# EAGLE design main_board_smd (EAGLE 6.6.0)
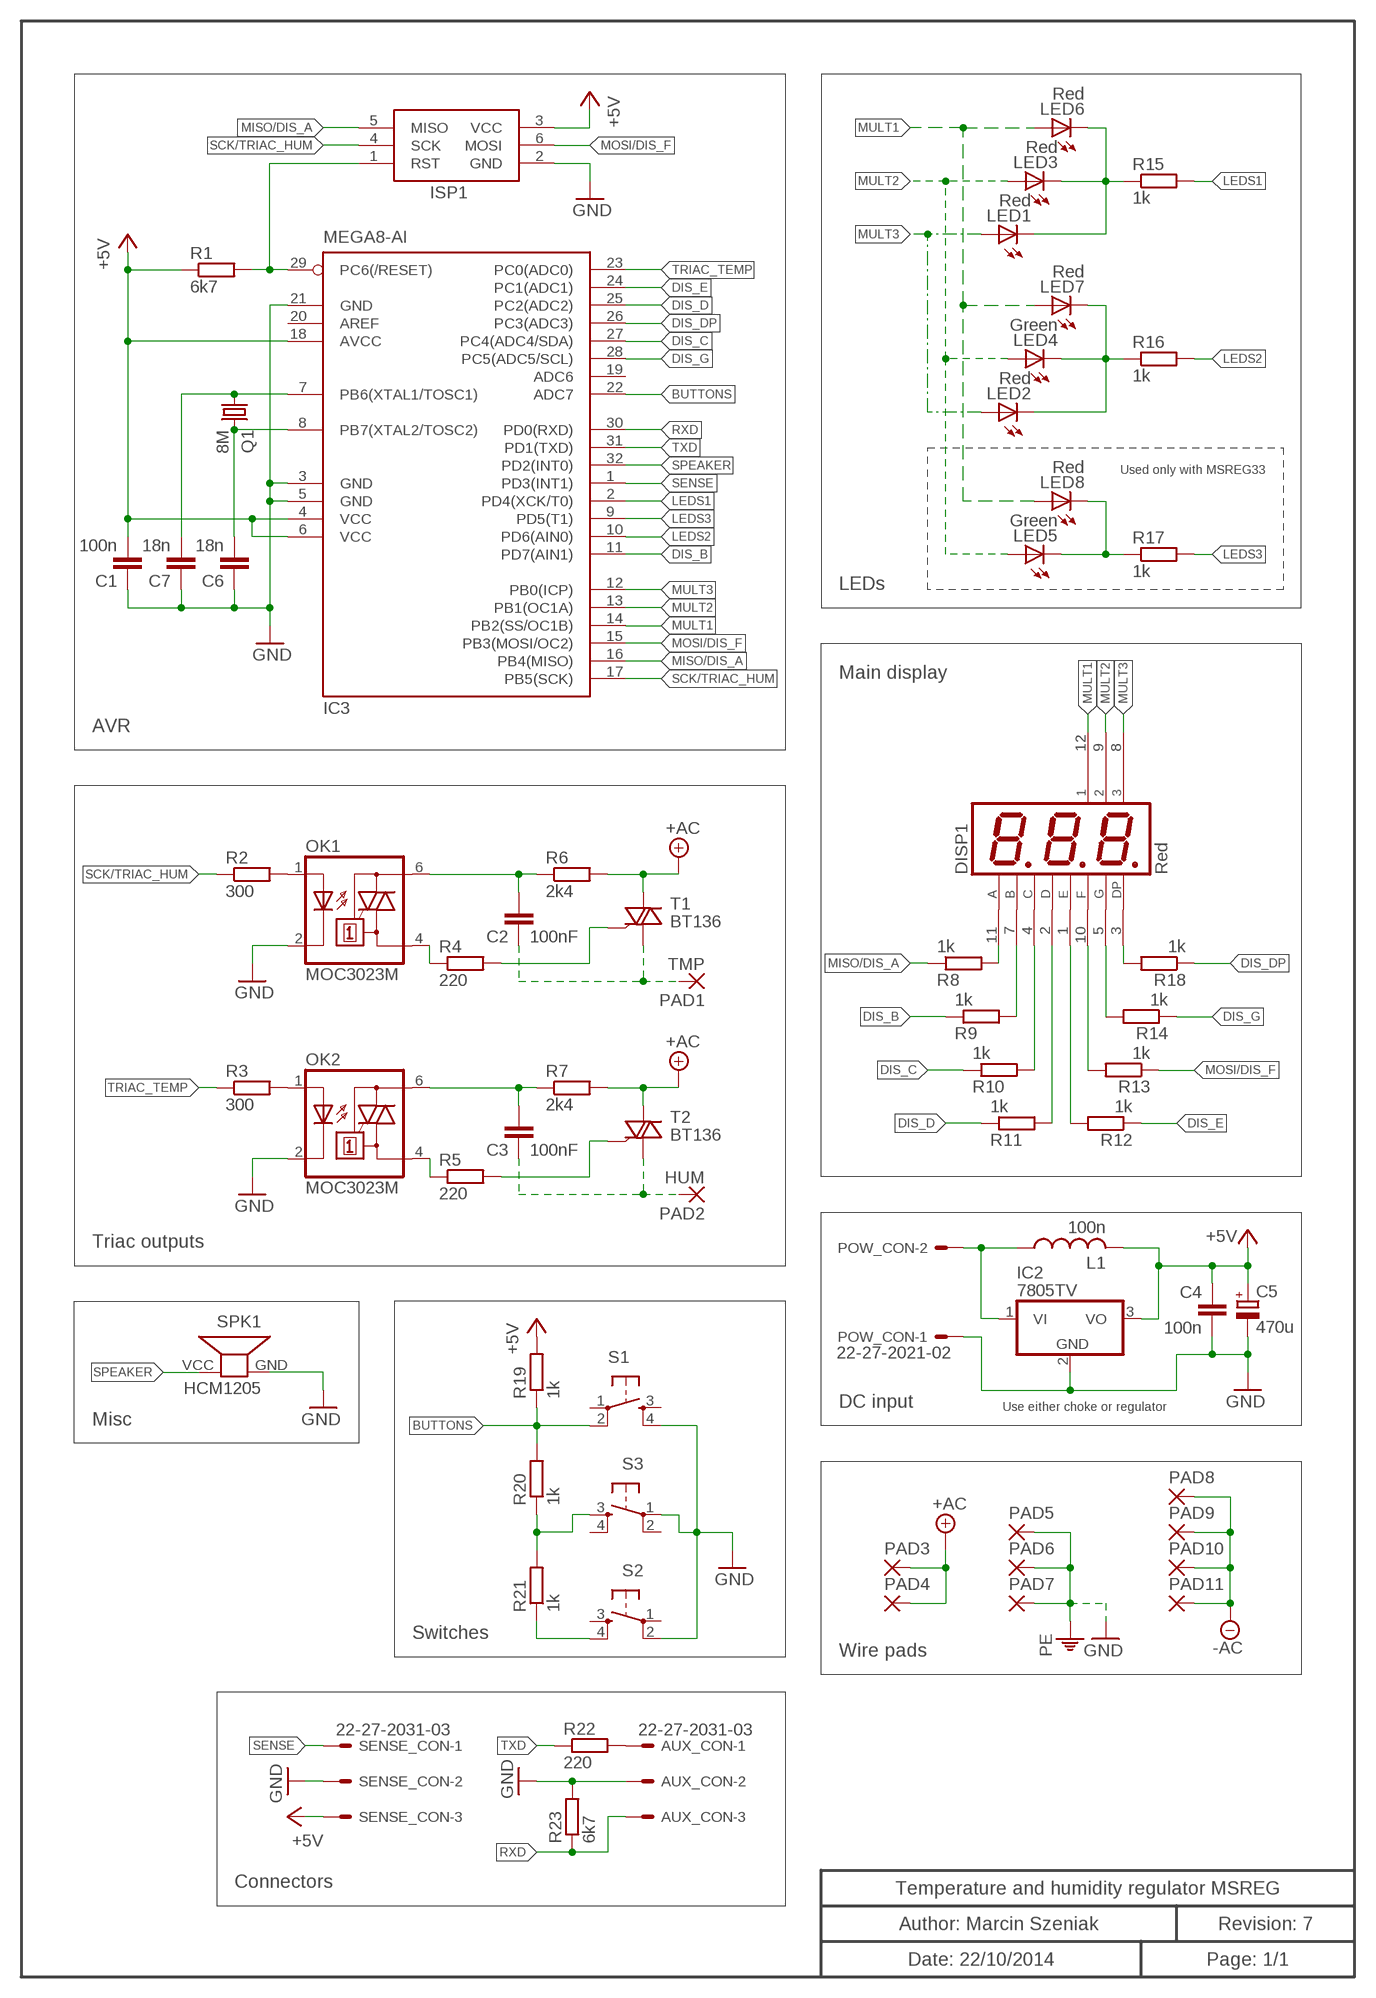
[diagram p0: schematic, sheet 1]

## Parts
AUX_CON  22-27-2031-03  [6410-03]
C1  100n  C2.5/4  [C2.5-4]
C2  100nF  C-EU102-054X133  [C102-054X133]
C3  100nF  C-EU102-054X133  [C102-054X133]
C4  100n  C2.5/2  [C2.5-2]
C5  470u  CPOL-EUTT2D7  [TT2D7]
C6  18n  C2.5/2  [C2.5-2]
C7  18n  C2.5/2  [C2.5-2]
DISP1  Red  7SEG3DIG  [7SEG3DIG]
IC2  7805TV  [TO220V]
IC3  MEGA8-AI  [TQFP32-08]
ISP1  AVRISPAV  [AVRISP-KLOC]
L1  100n  L-US0204/7  [0204/7]
LED1  Red  LED5MM  [LED5MM]
LED2  Red  LED5MM  [LED5MM]
LED3  Red  LED5MM  [LED5MM]
LED4  Green  LED5MM  [LED5MM]
LED5  Green  LED5MM  [LED5MM]
LED6  Red  LED5MM  [LED5MM]
LED7  Red  LED5MM  [LED5MM]
LED8  Red  LED5MM  [LED5MM]
OK1  MOC3023M  [DIL06]
OK2  MOC3023M  [DIL06]
PAD1  TMP  3,17/1,3KLOC  [KLOCWIRE]
PAD2  HUM  3,17/1,3KLOC  [KLOCWIRE]
PAD3  3,17/1,3KLOC  [KLOCWIRE]
PAD4  3,17/1,3KLOC  [KLOCWIRE]
PAD5  3,17/1,3KLOC  [KLOCWIRE]
PAD6  3,17/1,3KLOC  [KLOCWIRE]
PAD7  3,17/1,3KLOC  [KLOCWIRE]
PAD8  3,17/1,3KLOC  [KLOCWIRE]
PAD9  3,17/1,3KLOC  [KLOCWIRE]
PAD10  3,17/1,3KLOC  [KLOCWIRE]
PAD11  3,17/1,3KLOC  [KLOCWIRE]
POW_CON  22-27-2021-02  [6410-02]
Q1  8M  CRYSTALHC49U-V  [HC49U-V]
R1  6k7  R-EU_0204/5  [0204/5]
R2  300  R-EU_0204/7  [0204/7]
R3  300  R-EU_0204/7  [0204/7]
R4  220  R-EU_0204/7  [0204/7]
R5  220  R-EU_0207/10  [0207/10]
R6  2k4  R-EU_0411/3V  [0411V]
R7  2k4  R-EU_0411/12  [0411/12]
R8  1k  R-EU_0204/2V  [0204V]
R9  1k  R-EU_0204/2V  [0204V]
R10  1k  R-EU_0204/2V  [0204V]
R11  1k  R-EU_0204/2V  [0204V]
R12  1k  R-EU_0204/2V  [0204V]
R13  1k  R-EU_0204/2V  [0204V]
R14  1k  R-EU_0204/2V  [0204V]
R15  1k  R-EU_0204/5  [0204/5]
R16  1k  R-EU_0204/5  [0204/5]
R17  1k  R-EU_0204/7  [0204/7]
R18  1k  R-EU_0204/2V  [0204V]
R19  1k  R-EU_0204/5  [0204/5]
R20  1k  R-EU_0204/5  [0204/5]
R21  1k  R-EU_0204/5  [0204/5]
R22  220  R-EU_0204/7  [0204/7]
R23  6k7  R-EU_0204/7  [0204/7]
S1  TAC_SWITCHPTH  [TACTILE-PTH]
S2  TAC_SWITCHPTH  [TACTILE-PTH]
S3  TAC_SWITCHPTH  [TACTILE-PTH]
SENSE_CON  22-27-2031-03  [6410-03]
SPK1  HCM1205  [HCM12XX]
T1  BT136  TRIAC  [TRIAC_VE]
T2  BT136  TRIAC  [TRIAC_VE]

## Nets
+5V: C1.2 C4.1 C5.+ IC2.3(VO) IC3.4(VCC) IC3.6(VCC) IC3.18(AVCC) ISP1.3(VCC) L1.2 R1.1 R19.2 SENSE_CON.3
+UB: PAD3.1(P) PAD4.1(P) R6.2 R7.2 T1.A(A2) T2.A(A2) ; supply symbol labelled +AC
-UB: PAD8.1(P) PAD9.1(P) PAD10.1(P) PAD11.1(P) ; supply symbol labelled -AC
BUTTONS: IC3.22(ADC7) R19.1 R20.2 S1.2
DIS_B: IC3.11(PD7(AIN1)) R9.1
DIS_C: IC3.27(PC4(ADC4/SDA)) R10.1
DIS_D: IC3.25(PC2(ADC2)) R11.1
DIS_DP: IC3.26(PC3(ADC3)) R18.1
DIS_E: IC3.24(PC1(ADC1)) R12.1
DIS_G: IC3.28(PC5(ADC5/SCL)) R14.1
GND: AUX_CON.2 C1.1 C4.2 C5.- C6.1 C7.1 IC2.2(GND) IC3.3(GND) IC3.5(GND) IC3.21(GND) ISP1.2(GND) OK1.2(C) OK2.2(C) PAD5.1(P) PAD6.1(P) PAD7.1(P) POW_CON.1 R23.2 S1.4 S2.2 S3.1 SENSE_CON.2 SPK1.GND ; supply symbol labelled PE
LEDS1: IC3.2(PD4(XCK/T0)) R15.2
LEDS2: IC3.10(PD6(AIN0)) R16.2
LEDS3: IC3.9(PD5(T1)) R17.2
MISO/DIS_A: IC3.16(PB4(MISO)) ISP1.5(MISO) R8.1
MOSI/DIS_F: IC3.15(PB3(MOSI/OC2)) ISP1.6(MOSI) R13.1
MULT1: DISP1.12 IC3.14(PB2(SS/OC1B)) LED6.A LED7.A LED8.A
MULT2: DISP1.9 IC3.13(PB1(OC1A)) LED3.A LED4.A LED5.A
MULT3: DISP1.8 IC3.12(PB0(ICP)) LED1.A LED2.A
N$1: DISP1.3(DP) R18.2
N$2: DISP1.2(D) R11.2
N$3: DISP1.4(C) R10.2
N$4: DISP1.7(B) R9.2
N$5: DISP1.11(A) R8.2
N$6: DISP1.1(E) R12.2
N$7: DISP1.10(F) R13.2
N$8: DISP1.5(G) R14.2
N$9: C7.2 IC3.7(PB6(XTAL1/TOSC1)) Q1.1
N$10: C6.2 IC3.8(PB7(XTAL2/TOSC2)) Q1.2
N$12: LED1.K(C) LED3.K(C) LED6.K(C) R15.1
N$13: LED5.K(C) LED8.K(C) R17.1
N$14: IC2.1(VI) L1.1 POW_CON.2
N$15: LED2.K(C) LED4.K(C) LED7.K(C) R16.1
N$21: C2.1 OK1.6(A2) R6.1
N$22: C2.2 PAD1.1(P) T1.C(A1)
N$23: OK2.1(A) R3.2
N$24: OK2.4(A1) R5.1
N$25: R5.2 T2.G
N$26: OK1.4(A1) R4.1
N$28: C3.1 OK2.6(A2) R7.1
N$29: C3.2 PAD2.1(P) T2.C(A1)
N$31: AUX_CON.1 R22.2
N$32: R4.2 T1.G
N$34: R20.1 R21.2 S3.3
N$35: R21.1 S2.4
N$1934: OK1.1(A) R2.2
RESET: IC3.29(PC6(/RESET)) ISP1.1(RST) R1.2
RXD: AUX_CON.3 IC3.30(PD0(RXD)) R23.1
SCK/TRIAC_HUM: IC3.17(PB5(SCK)) ISP1.4(SCK) R2.1
SENSE: IC3.1(PD3(INT1)) SENSE_CON.1
SPEAKER: IC3.32(PD2(INT0)) SPK1.VCC
TRIAC_TEMP: IC3.23(PC0(ADC0)) R3.1
TXD: IC3.31(PD1(TXD)) R22.1
Unconnected: IC3.19(ADC6) IC3.20(AREF) S1.1 S1.3 S2.1 S2.3 S3.2 S3.4

## Notes on the sheet
- Used only with MSREG33
- LEDs
- Main display
- AVR
- Triac outputs
- DC input | Use either choke or regulator
- Misc
- Switches
- Wire pads
- Connectors | Temperature and humidity regulator MSREG
- Author: Marcin Szeniak | Revision: 7
- Date: 22/10/2014 | Page: 1/1

## Library data of the parts
AUX_CON SENSE_CON = con-molex:22-?-03: CONNECTOR wire to board 2.54 mm (.1 inch) pitch header; OC_FARNELL: unknown; OC_NEWARK: unknown
C1 C4 C6 C7 = capacitor-wima:C: CAPACITOR naming: grid - package width
C2 C3 = rcl:C-EU: CAPACITOR, European symbol
C5 = rcl:CPOL-EU: POLARIZED CAPACITOR, European symbol
DISP1 = temp_control:7SEG3DIG
IC2 = linear:78*: Positive VOLTAGE REGULATOR Source: http://cache.national.com/ds/LM/LM78L05.pdf http://www.fairchildsemi.com/ds/LM/LM7805.pdf
IC3 = atmel:MEGA8: MICROCONTROLLER 8 Kbytes FLASH, 1 kbytes SRAM, 512 bytes EEPROM, USART, 6-channel 10 bit ADC, 2-channel 8 bit ADC Pin compatible with Atmega48, ATMega88, ATMega168 Source: avr.lbr; MPN: ATMEGA8-16AU; OC_FARNELL: 9171371; OC_NEWARK: 73M8863
ISP1 = adafruit:AVRISP: AVR ISP HEADER Standard 6 pin header for AVR programming
L1 = rcl:L-US: INDUCTOR, American symbol
LED1-LED8 = adafruit:LED: LED OSRAM: - CHIPLED LG R971, LG N971, LY N971, LG Q971, LY Q971, LO R971, LY R971 LH N974, LH R974 LS Q976, LO Q976, LY Q976 LO Q996 - Hyper CHIPLED LW Q18S LB Q993, LB Q99A, LB R99A - SideLED LS A670, LO A670, LY A670, LG A670, LP A670 LB A673, LV A673, LT A673, LW A673 LH A674 LY A675 LS A676, LA A676, LO A676, LY A676, LW A676 LS A679, LY A679, LG A679 - Hyper Micro SIDELED® LS Y876, LA Y876, LO Y876, LY Y876 LT Y87S - SmartLED LW L88C, LW L88S LB L89C, LB L89S, LG L890 LS L89K, LO L89K, LY L89K LS L896, LA L896, LO L896, LY L896 - TOPLED LS T670, LO T670, LY T670, LG T670, LP T670 LSG T670, LSP T670, LSY T670, LOP T670, LYG T670 LG T671, LOG T671, LSG T671 LB T673, LV T673, LT T673, LW T673 LH T674 LS T676, LA T676, LO T676, LY T676, LB T676, LH T676, LSB T676, LW T676 LB T67C, LV T67C, LT T67C, LS T67K, LO T67K, LY T67K, LW E67C LS E67B, LA E67B, LO E67B, LY E67B, LB E67C, LV E67C, LT E67C LW T67C LS T679, LY T679, LG T679 LS T770, LO T770, LY T770, LG T770, LP T770 LB T773, LV T773, LT T773, LW T773 LH T774 LS E675, LA E675, LY E675, LS T675 LS T776, LA T776, LO T776, LY T776, LB T776 LHGB T686 LT T68C, LB T68C - Hyper Mini TOPLED® LB M676 - Mini TOPLED Santana® LG M470 LS M47K, LO M47K, LY M47K Source: http://www.osram.convergy.de/
OK1 OK2 = optocoupler:MOC30*M: RANDOM-PHASE OPTOISOLATORS TRIAC DRIVER OUTPUT Source: http://www.fairchildsemi.com MOC3020-M.pdf; MF: FAIRCHILD SEMICONDUCTOR; MPN: MOC3023-M; OC_FARNELL: 1021367; OC_NEWARK: 72K8896
PAD1-PAD11 = wirepad:3,17/1,3: THROUGH-HOLE PAD
POW_CON = con-molex:22-?-02: CONNECTOR wire to board 2.54 mm (.1 inch) pitch header; OC_FARNELL: unknown; OC_NEWARK: unknown
Q1 = crystal:CRYSTAL: CRYSTAL; OC_FARNELL: 1666969; OC_NEWARK: unknown
R1-R23 = resistor:R-EU_: RESISTOR, European symbol
S1-S3 = SparkFun-Electromechanical:TAC_SWITCH: Momentary Switch Button commonly used for reset or general input. Spark Fun Electronics SKU : COM-00097 SMT- SWCH-08247
SPK1 = temp_control:HCM1205
T1 T2 = _custom:TRIAC

## Board
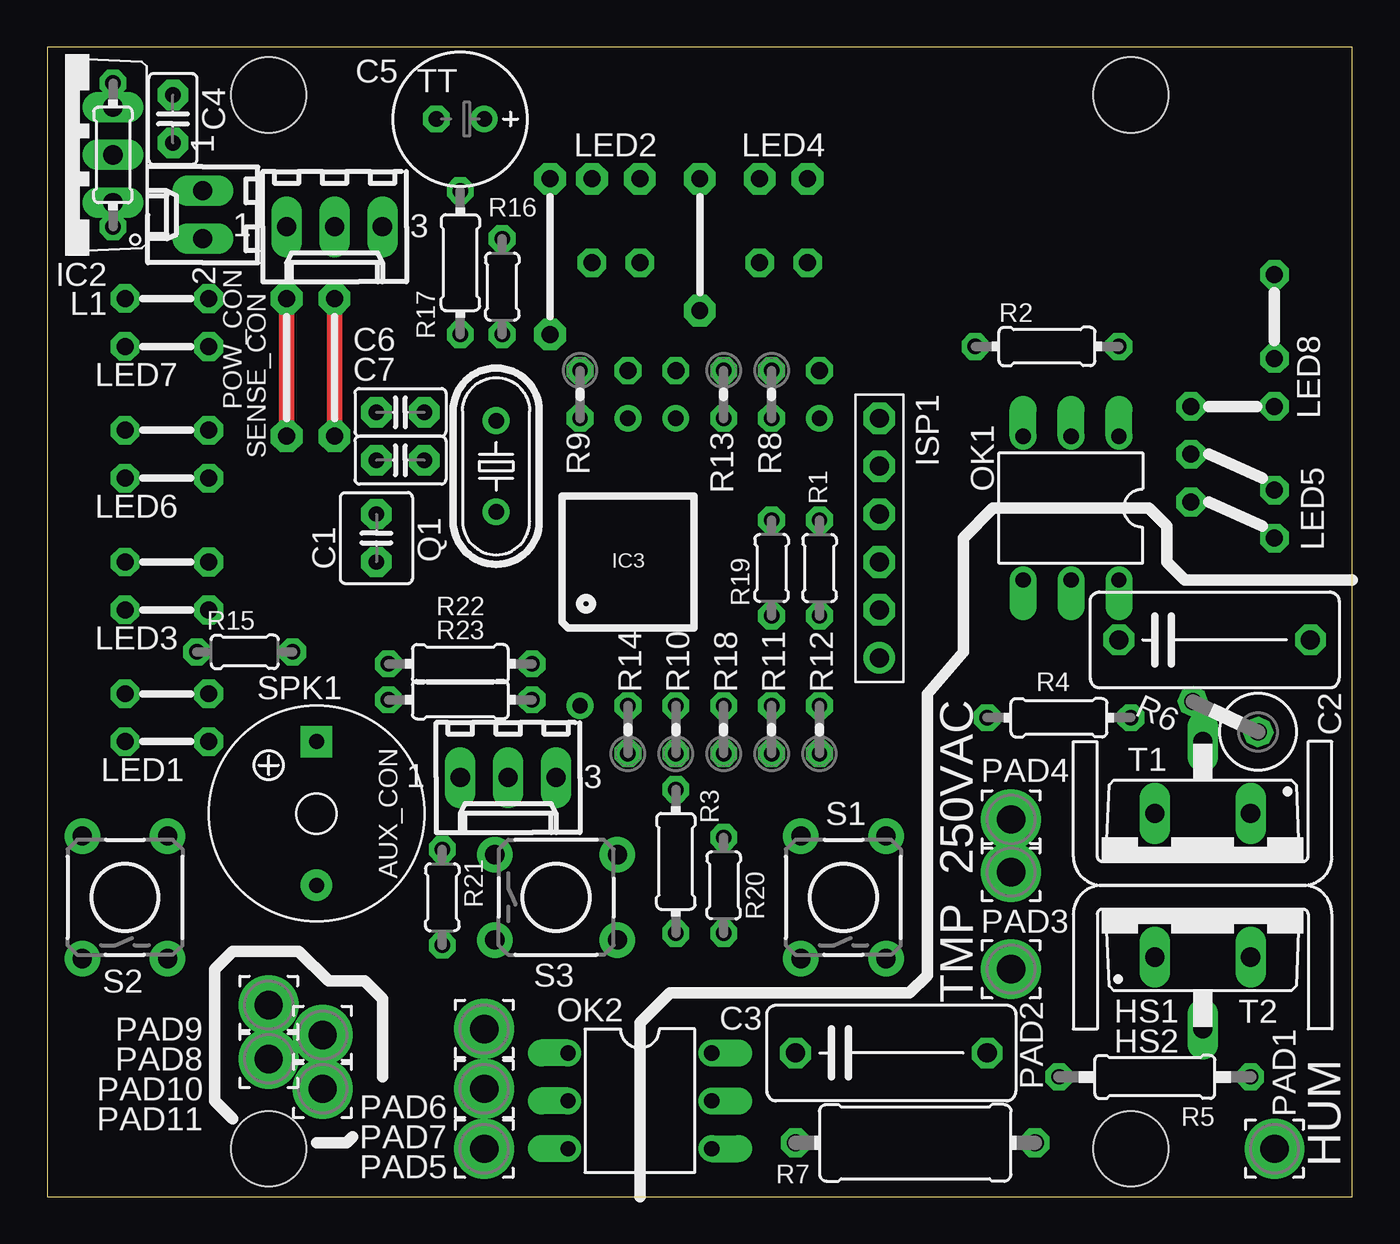
[diagram p1: board, top side]
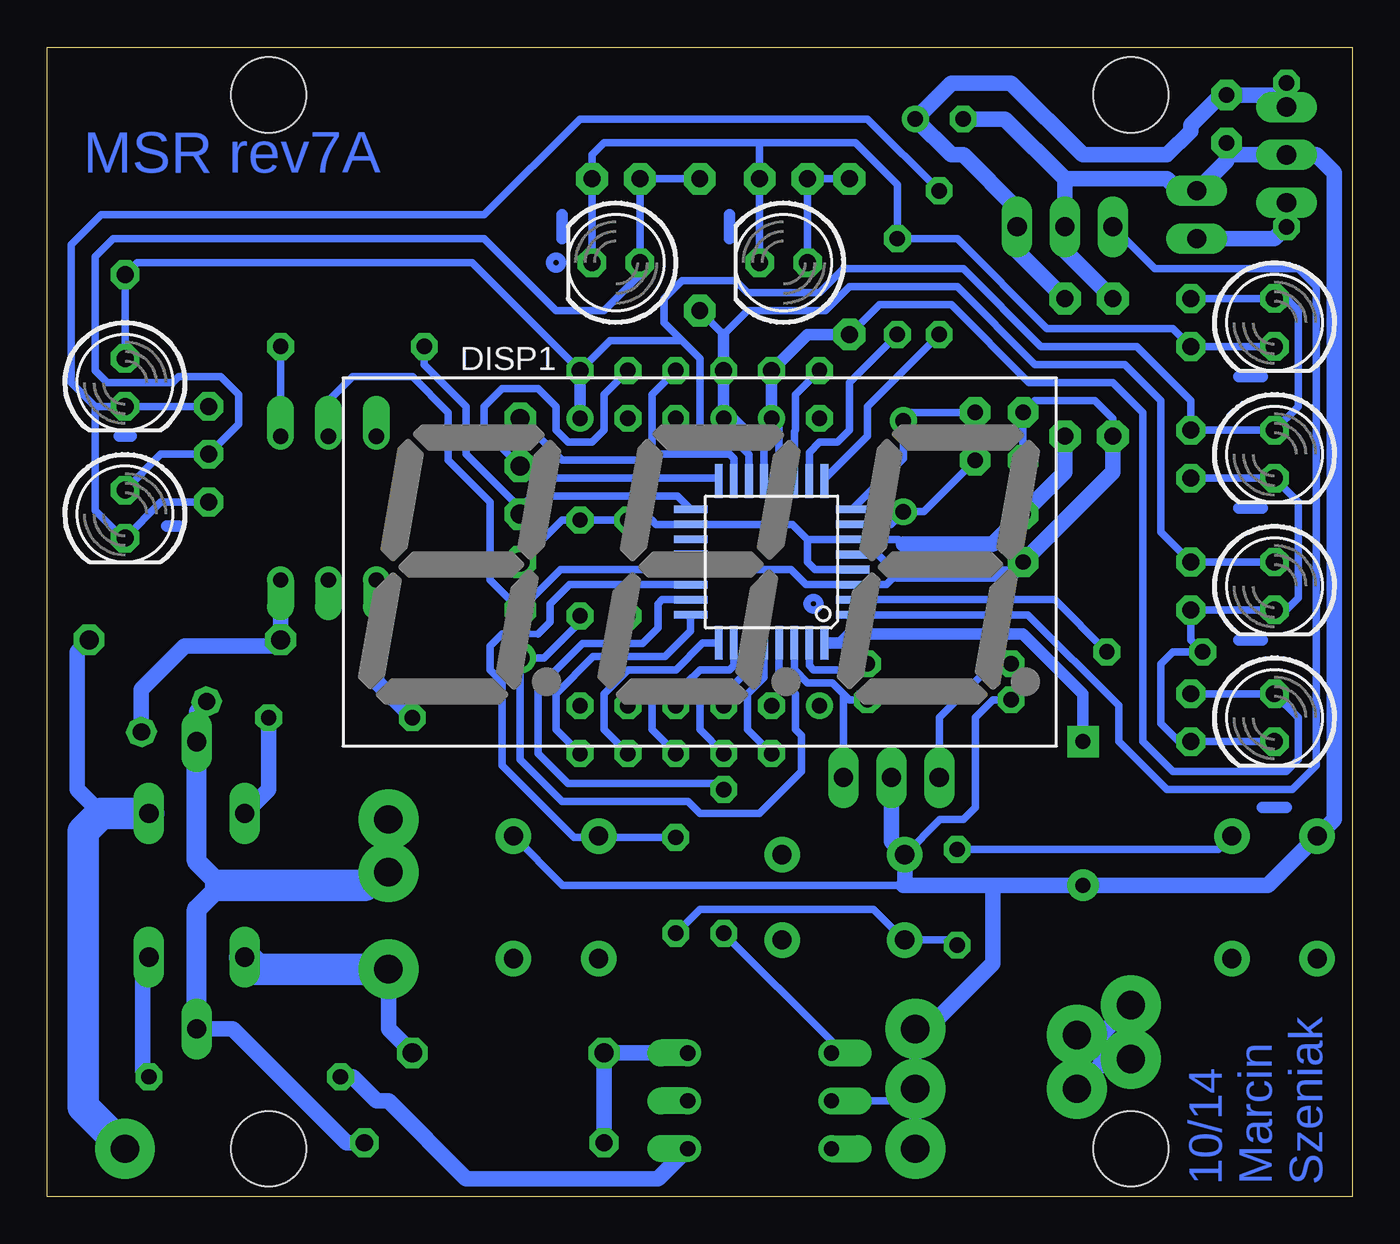
[diagram p2: board, bottom side, seen from below]

Size 69.21 x 60.96 mm. Coordinates in mm from the lower left corner, seen from the top.
Outline: 0,0 69.21,0 69.21,60.96 0,60.96 0,0
Copper layers (1*16): Top 0.035mm / dielectric 1.5mm / Bottom 0.035mm
Design rules "sparkfun_kloc *": minimum track width 16mil, minimum drill 20mil, track to track 10mil, track to pad 10mil, pad to pad 10mil, via to via 10mil, smd to smd 8mil, copper to edge 25mil, drill to drill 10mil, minimum pad ring 12mil, minimum via ring 10mil, stop-mask expansion 4mil, vias tented up to drill 25mil, thermal gap 10mil
Holes 4 mm at 11.75,58.42 57.47,58.42 57.47,2.54 11.75,2.54

### Footprints (pad centres in the part's own frame; a part is rotated, then mirrored left to right if it is on the bottom)
6410-03 = drill 1.016 long: 1 2.54,0; 2 0,0; 3 -2.54,0
C2.5-4 = drill 0.813 pad 1.6 octagon: 1 -1.27,0; 2 1.27,0
C102-054X133 = drill 1.016 octagon: 1 -5.08,0; 2 5.08,0
C2.5-2 = drill 0.813 pad 1.6 octagon: 1 -1.27,0; 2 1.27,0
TT2D7 = drill 0.813: + -1.27,0 | drill 0.813 octagon: - 1.27,0
7SEG3DIG = drill 0.813: 1 -6.35,-7.62; 2 -3.81,-7.62; 3 -1.27,-7.62; 4 1.27,-7.62; 5 3.81,-7.62; 6 6.35,-7.62; 7 6.35,7.62; 8 3.81,7.62; 9 1.27,7.62; 10 -1.27,7.62; 11 -3.81,7.62; 12 -6.35,7.62
TO220V = drill 1.016 long: 1 -2.54,-2.54; 2 0,-2.54; 3 2.54,-2.54
TQFP32-08 = smd 1.778 x 0.406: 1 -4.293,2.8; 2 -4.293,2; 3 -4.293,1.2; 4 -4.293,0.4; 5 -4.293,-0.4; 6 -4.293,-1.2; 7 -4.293,-2; 8 -4.293,-2.8; 17 4.293,-2.8; 18 4.293,-2; 19 4.293,-1.2; 20 4.293,-0.4; 21 4.293,0.4; 22 4.293,1.2; 23 4.293,2; 24 4.293,2.8 | smd 0.406 x 1.778: 9 -2.8,-4.293; 10 -2,-4.293; 11 -1.2,-4.293; 12 -0.4,-4.293; 13 0.4,-4.293; 14 1.2,-4.293; 15 2,-4.293; 16 2.8,-4.293; 25 2.8,4.293; 26 2,4.293; 27 1.2,4.293; 28 0.4,4.293; 29 -0.4,4.293; 30 -1.2,4.293; 31 -2,4.293; 32 -2.8,4.293
AVRISP-KLOC = drill 1 pad 1.676: 1 -6.35,0 | drill 1 pad 1.676 octagon: 2 -3.81,0; 3 -1.27,0; 4 1.27,0; 5 3.81,0; 6 6.35,0
0204/7 = drill 0.813 octagon: 1 -3.81,0; 2 3.81,0
LED5MM = drill 0.9 pad 1.422 octagon: A -1.27,0; K 1.27,0
DIL06 = drill 0.813 offset: 1 -2.54,-3.81; 2 0,-3.81; 3 2.54,-3.81; 4 2.54,3.81; 5 0,3.81; 6 -2.54,3.81
KLOCWIRE = drill 1.5 pad 3.175: 1 0,0
6410-02 = drill 1.016 long: 1 1.27,0; 2 -1.27,0
HC49U-V = drill 0.813: 1 -2.413,0; 2 2.413,0
0204/5 = drill 0.813 octagon: 1 -2.54,0; 2 2.54,0
0207/10 = drill 0.813 octagon: 1 -5.08,0; 2 5.08,0
0411V = drill 0.914 octagon: 1 -2.54,0; 2 1.27,0
0411/12 = drill 0.914 octagon: 1 -6.35,0; 2 6.35,0
0204V = drill 0.813 octagon: 1 -1.27,0; 2 1.27,0
TACTILE-PTH = drill 1.016 pad 1.88: 1 -3.251,2.261; 2 3.251,2.261; 3 -3.251,-2.261; 4 3.251,-2.261
HCM12XX = drill 0.8 pad 1.676: GND -3.81,0 | drill 0.8 pad 1.676 square: VCC 3.81,0
TRIAC_VE = drill 1.016 long: A 0,-6.35; C -2.54,-2.54; G 2.54,-2.54

### Placement (x,y rotation side)
AUX_CON  24.45,22.23 180 top
C1  17.46,34.92 90 top
C2  61.91,29.53 0 top
C3  44.77,7.62 0 top
C4  6.67,57.15 270 top
C5  21.91,57.15 180 top
C6  18.73,41.59 0 top
C7  18.73,39.05 0 top
DISP1  34.61,33.66 0 bottom
HS1  [D03S]  61.28,17.78 0 top
HS2  [D03S]  61.28,15.24 180 top
IC2  0.95,55.24 90 top
IC3  30.8,33.66 180 bottom
ISP1  44.13,34.92 90 top
L1  3.49,55.24 90 top
LED1  4.13,25.4 270 bottom
LED2  30.16,49.53 180 bottom
LED3  4.13,32.38 270 bottom
LED4  39.05,49.53 180 bottom
LED5  65.09,36.2 270 bottom
LED6  4.13,39.37 270 bottom
LED7  4.13,46.35 270 bottom
LED8  65.09,43.18 270 bottom
OK1  54.29,36.51 180 top
OK2  31.43,5.08 270 top
PAD1  65.09,2.54 270 top
PAD2  51.12,12.06 0 top
PAD3  51.12,17.21 90 top
PAD4  51.12,20 270 top
PAD5  23.18,2.54 90 top
PAD6  23.18,8.89 90 top
PAD7  23.18,5.71 90 top
PAD8  11.75,7.3 90 top
PAD9  11.75,10.16 270 top
PAD10  14.61,8.57 270 top
PAD11  14.61,5.71 90 top
POW_CON  8.26,52.07 90 top
Q1  23.81,38.73 90 top
R1  40.96,33.34 270 top
R2  53.02,45.09 0 top
R3  33.34,17.78 270 top
R4  53.66,25.4 0 top
R5  58.74,6.35 0 top
R6  61.91,25.72 155 top
R7  46.04,2.86 0 top
R8  38.42,42.55 270 top
R9  28.26,42.55 270 top
R10  33.34,24.77 90 top
R11  38.42,24.77 90 top
R12  40.96,24.77 90 top
R13  35.88,42.55 270 top
R14  30.8,24.77 90 top
R15  10.48,28.89 0 top
R16  24.13,48.26 270 top
R17  21.91,49.53 270 top
R18  35.88,24.77 90 top
R19  38.42,33.34 90 top
R20  35.88,16.51 90 top
R21  20.95,15.88 270 top
R22  21.91,28.26 180 top
R23  21.91,26.35 180 top
S1  42.23,15.88 90 top
S2  4.13,15.88 90 top
S3  26.99,15.88 0 top
SENSE_CON  15.24,51.44 180 top
SPK1  14.29,20.32 90 top
T1  61.28,17.78 180 top
T2  61.28,15.24 0 top

### Tracks (layer width: path | path; a pad name or v marks a point on that pad's centre or on a via)
+5V  (via drill 0.9 pad 1.68)
  Top 0.813: v15.24,40.32 v15.24,47.62
  Bottom 0.406: IC3.4 28.49,33.26 28.89,33.66 28.89,34.85 | 28.89,34.85 IC3.6 24.06,34.85 23.81,34.61 | 28.89,34.85 29.69,35.66 IC3.18 36.93,35.66 37.15,35.88 R19.2 R1.1 41.91,35.88 ISP1.3
  Bottom 0.813: L1.2 IC2.3 3.49,58.42 C4.1 6.99,58.42 8.57,56.83 8.57,56.52 9.84,55.24 14.29,55.24 18.1,59.05 21.27,59.05 C5.+ 21.27,55.24 20.64,55.24 17.78,52.39 SENSE_CON.3 17.78,50.16 v15.24,47.62 | v15.24,40.32 15.24,38.42 C1.2 19.05,34.61 23.81,34.61
+UB
  Bottom 0.813: PAD4.1 PAD3.1 | R7.2 53.34,2.86 59.37,8.89 T2.A | R6.2 61.28,25.74 T1.A
  Bottom 1.067: T2.A 61.28,15.24 60.01,16.51 61.28,17.78 T1.A
  Bottom 1.422: PAD4.1 51.12,17.78 52.39,16.51
  Bottom 1.676: 52.39,16.51 60.01,16.51
-UB
  Bottom 0.813: PAD11.1 13.34,6.99 13.34,7.3 | 13.34,7.3 PAD8.1 | 13.34,8.57 PAD9.1 | PAD10.1 13.34,8.57 | 13.34,8.57 13.34,7.3
BUTTONS
  Bottom 0.356: 45.08,29.84 43.18,29.84
  Bottom 0.406: 43.18,29.84 42.54,30.48 42.54,31.43 41.52,32.45 38.42,32.45 | 38.42,32.45 IC3.22 | R20.2 39.69,19.05 | 39.69,19.05 41.28,19.05 45.08,22.86 45.08,27.3 45.72,27.94 45.72,29.21 45.08,29.84 | S1.2 39.76,19.13 39.69,19.05 | R19.1 38.42,32.45
DIS_B
  Bottom 0.406: IC3.11 29.6,40.57 29.53,40.64 29.53,42.55 R9.1
DIS_C
  Bottom 0.406: R10.1 34.61,24.77 34.61,26.67 34.04,27.24 32.7,27.24 32,27.95 IC3.27
DIS_D
  Bottom 0.406: R11.1 39.69,24.77 39.69,26.67 38.42,27.94 35.88,27.94 34.46,29.36 IC3.25
DIS_DP
  Bottom 0.406: R18.1 37.15,24.77 37.15,26.67 36.58,27.24 35.31,27.24 34.61,27.94 33.02,27.94 32.8,28.16 IC3.26
DIS_E
  Bottom 0.406: R12.1 42.23,24.77 42.23,26.67 40.26,28.64 36.45,28.64 35.09,30 IC3.24
DIS_G
  Bottom 0.406: R14.1 32.07,24.77 32.07,26.67 31.2,27.54 IC3.28
GND  (via drill 0.9 pad 1.68)
  Top 0.813: v12.7,40.32 v12.7,47.62
  Bottom 0.406: IC3.5 25.17,34.05 24.13,33.02 24.7,32.45 IC3.3 28.96,32.45 29.76,33.26 IC3.21 41.99,33.26 ISP1.2 45.72,32.7 45.72,36.83 47.94,39.05 47.94,41.59 49.85,43.5 53.02,43.5 54.29,42.23 OK1.2 | v12.7,40.32 12.7,41.27 13.65,42.23 16.83,42.23 C6.1 C7.1 | S1.4 41.87,16.51 23.81,16.51 23.74,16.59 | OK2.2 23.18,5.08 | R23.2 19.05,26.35 20,25.4 20,20.64 20.64,20 21.87,20 S3.1
  Bottom 0.61: 23.18,5.08 PAD6.1 PAD7.1 PAD5.1 | S2.2 1.83,19.13
  Bottom 0.813: C5.- 18.42,57.15 15.24,53.98 | 15.24,53.98 SENSE_CON.2 15.24,50.16 v12.7,47.62 | 15.24,53.98 9.84,53.98 9.21,53.34 POW_CON.1 6.67,54.93 C4.2 6.67,55.24 IC2.2 1.9,55.24 0.95,54.29 0.95,20 1.83,19.13 | 23.81,16.51 19.05,16.51 | 19.05,16.51 19.05,12.38 22.54,8.89 PAD6.1 | 23.74,16.59 S3.1 24.45,18.85 AUX_CON.2 | 19.05,16.51 SPK1.GND 4.48,16.51 S2.2 | 24.13,33.02 18.1,33.02 C1.1 12.7,38.42 v12.7,40.32
LEDS1
  Bottom 0.406: IC3.2 15.78,31.66 R15.2
LEDS2
  Bottom 0.406: IC3.10 28.8,39.47 28.26,40.01 27.31,40.01 26.67,40.64 26.67,43.18 R16.2
LEDS3
  Bottom 0.406: R17.2 25.72,41.91 25.72,40.32 28,38.04 IC3.9
MISO/DIS_A
  Bottom 0.406: IC3.16 33.75,38.1 43.5,38.1 ISP1.5 46.04,40.64 46.04,41.91 45.08,42.86 43.18,42.86 42.23,41.91 42.23,40.64 41.59,40.01 40.32,40.01 39.69,40.64 39.69,42.55 R8.1
MOSI/DIS_F
  Bottom 0.406: IC3.15 32.8,39.15 33.02,39.37 37.15,39.37 | 37.15,39.37 37.15,42.55 R13.1 | 37.15,39.37 37.47,39.05 41.91,39.05 ISP1.6
MULT1  (via drill 0.9 pad 1.42, 0.9 pad 1.52)
  Bottom 0.406: v8.57,47.62 LED7.A 3.49,47.62 2.86,46.99 2.86,41.91 LED6.A v8.57,40.64 8.57,42.23 11.43,45.09 16.51,45.09 20.64,49.21 26.99,49.21 28.26,47.94 32.07,47.94 32.7,48.58 35.56,48.58 36.51,47.62 36.51,46.35 35.56,45.4 | LED8.A v65.09,48.9 64.45,49.53 46.67,49.53 v40.96,43.81 39.37,45.4 35.56,45.4 | IC3.14 32,39.36 32.7,40.07 34.04,40.07 34.61,40.64 34.61,44.45 35.56,45.4
  Bottom 0.61: DISP1.12 v40.96,43.81
MULT2  (via drill 0.9 pad 1.42, 0.9 pad 1.52, 0.9 pad 1.68)
  Top 0.406: v34.61,46.99 v34.61,53.98
  Bottom 0.406: LED5.A 63.18,39.37 v60.64,39.37 59.05,40.96 59.05,42.55 60.01,43.5 62.23,43.5 62.55,43.18 66.04,43.18 66.68,43.81 66.68,49.85 65.72,50.8 46.04,50.8 42.23,46.99 39.69,46.99 37.78,48.9 LED4.A v37.78,53.98 v34.61,53.98 | LED3.A v8.57,33.66 10.16,35.24 10.16,42.23 12.07,44.13 16.83,44.13 20.95,48.26 26.67,48.26 27.94,46.99 32.07,46.99 33.34,45.72 v34.61,46.99 | IC3.13 31.2,39.77 32.7,41.27 DISP1.9
  Bottom 0.61: DISP1.9 v33.34,43.81 33.34,45.72
MULT3  (via drill 0.9 pad 1.42, 0.9 pad 1.52, 0.9 pad 1.68)
  Top 0.406: v26.67,45.72 v26.67,53.98
  Bottom 0.406: LED2.A v28.89,53.98 v26.67,53.98 | v8.57,26.67 LED1.A 2.86,25.4 2.86,23.18 3.49,22.54 9.52,22.54 11.11,24.13 11.11,41.59 12.7,43.18 17.15,43.18 21.27,47.31 25.08,47.31 v26.67,45.72 | 30.95,41.27 DISP1.8 30.4,40.88 IC3.12
  Bottom 0.61: DISP1.8 v30.8,43.81 28.89,45.72 v26.67,45.72
N$9
  Bottom 0.406: IC3.7 24.48,35.66 Q1.1 22.73,36.32 C7.2
N$10
  Bottom 0.406: C6.2 23.37,41.59 Q1.2 23.81,39.15 IC3.8
N$11
  Bottom 0.61: 33.02,50.8 33.02,52.07
N$12  (via drill 0.9 pad 1.52)
  Bottom 0.406: LED1.K v8.57,24.13 9.21,24.13 10.16,25.08 10.16,28.26 9.52,28.89 R15.1 8.57,29.53 v8.57,31.11 LED3.K 3.49,31.11 2.86,31.75 2.86,36.83 LED6.K v8.57,38.1
N$13  (via drill 0.9 pad 1.52)
  Bottom 0.406: v60.64,36.83 63.18,36.83 LED5.K 65.21,34.92 66.68,36.39 66.68,41.91 | v60.64,41.91 LED8.K 66.68,41.91 | 66.68,41.91 67.94,43.18 67.94,50.48 66.36,52.07 46.04,52.07 40.96,57.15 25.72,57.15 R17.1
N$14
  Bottom 0.813: IC2.1 L1.1 4.13,50.8 4.76,50.8 POW_CON.2
N$15  (via drill 0.9 pad 1.52, 0.9 pad 1.68)
  Bottom 0.406: LED7.K v8.57,45.09 9.52,46.04 16.19,46.04 20.95,50.8 R16.1 24.13,53.66 26.35,55.88 31.43,55.88 | LED2.K v31.43,53.98 31.43,55.88 | LED4.K v40.32,53.98 40.32,55.24 39.69,55.88 31.43,55.88
N$16
  Bottom 0.61: 41.91,50.8 41.91,52.07
N$17
  Bottom 0.61: 64.77,40.32 65.41,40.32
N$18
  Bottom 0.61: 62.23,35.56 62.86,35.56
N$19
  Bottom 0.61: 4.76,43.5 6.03,43.5
N$20
  Bottom 0.61: 4.76,36.51 6.03,36.51
N$21
  Bottom 0.813: OK1.6 C2.1 57.15,29.21 61.91,29.21 64.21,26.91 R6.1
N$22
  Bottom 0.813: C2.2 67.63,28.89 67.63,21.59 66.36,20.32
  Bottom 1.676: PAD1.1 67.31,4.76 67.31,19.37 66.36,20.32 T1.C
N$23
  Bottom 0.406: OK2.1 27.62,8.26 R3.2
N$24
  Bottom 0.813: OK2.4 36.83,0.95 46.99,0.95 51.12,5.08 51.75,5.08 53.02,6.35 R5.1
N$25
  Bottom 0.813: R5.2 64.14,6.67 64.14,12.38 T2.G
N$26
  Bottom 0.813: R4.1 51.75,27.3 OK1.4
N$27
  Bottom 0.61: 4.76,29.53 6.03,29.53
N$28
  Bottom 0.813: R7.1 C3.1 OK2.6
N$29
  Bottom 0.813: C3.2 51.12,8.89 PAD2.1
  Bottom 1.676: T2.C 58.1,12.06 PAD2.1
N$30
  Bottom 0.61: 3.49,20.64 4.76,20.64
N$31
  Bottom 0.406: R22.2 19.05,28.26 21.91,25.4 AUX_CON.1
N$32
  Bottom 0.813: T1.G 57.47,21.59 R4.2
N$34
  Bottom 0.406: R20.1 34.61,15.24 25.4,15.24 23.77,13.61 S3.3 21.23,13.61 R21.2
N$35
  Bottom 0.406: R21.1 7.1,18.41 S2.4
N$1934
  Bottom 0.406: OK1.1 R2.2
RESET
  Bottom 0.406: IC3.29 30.4,27.54 29.53,26.67 29.53,24.77 29.21,24.45 29.21,22.54 31.43,20.32 34.61,20.32 35.24,20.95 41.91,20.95 44.13,23.18 ISP1.1 42.86,28.57 40.96,30.48 R1.2
RXD
  Bottom 0.406: AUX_CON.3 26.99,26.67 | IC3.30 29.6,27.95 28.89,27.24 27.56,27.24 26.99,26.67 | R23.1 26.67,26.35 26.99,26.67
SCK/TRIAC_HUM
  Bottom 0.406: IC3.17 35.78,37.15 43.5,37.15 44.13,36.51 | R2.1 49.21,44.13 46.99,41.91 46.99,39.37 44.13,36.51 | 44.13,36.51 ISP1.4
SENSE
  Bottom 0.406: SENSE_CON.1 10.48,49.21 2.86,49.21 1.9,48.26 1.9,22.86 3.17,21.59 9.84,21.59 12.38,24.13 12.38,26.04 17.2,30.86 IC3.1
SPEAKER
  Bottom 0.406: IC3.32 27.77,29.36
  Bottom 0.61: SPK1.VCC 14.29,26.67 17.46,29.84 26.67,29.84 27.15,29.36 27.77,29.36
TRIAC_TEMP
  Bottom 0.406: R3.1 33.65,21.91 41.59,21.91 43.18,23.5 43.18,26.99 40.83,29.34 37.66,29.34 36.83,30.16 36.83,31.43 36.61,31.66 IC3.23
TXD
  Bottom 0.406: IC3.31 28.8,28.16 28.58,27.94 26.99,27.94 26.67,28.26 R22.1
(copper drawn outside any net)
  shapes: Bottom circle x2

### Text on the board
Bottom: MSR rev7A | 10/14 / Marcin / Szeniak
tPlace: 250VAC | TMP | HUM